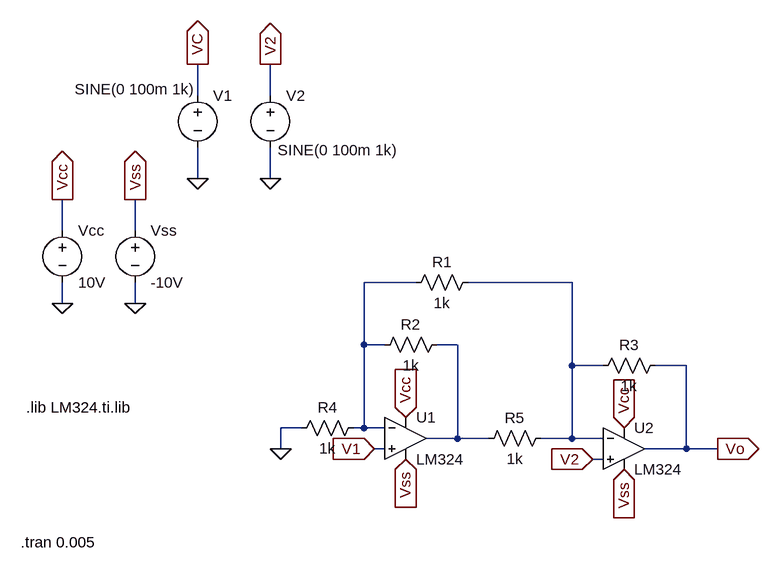
[diagram p0: schematic Circuito1.asc]
Circuito1.asc, the LTspice schematic file:
Version 4.1
SHEET 1 880 680
WIRE -336 -320 -336 -368
WIRE -224 -320 -224 -368
WIRE -336 -192 -336 -240
WIRE -224 -192 -224 -240
WIRE -544 -112 -544 -160
WIRE -432 -112 -432 -160
WIRE 0 -32 -80 -32
WIRE 240 -32 80 -32
WIRE -544 0 -544 -32
WIRE -432 0 -432 -32
WIRE -80 64 -80 -32
WIRE -48 64 -80 64
WIRE 64 64 32 64
WIRE 240 96 240 -32
WIRE 288 96 240 96
WIRE 416 96 368 96
WIRE -176 192 -208 192
WIRE -80 192 -80 64
WIRE -80 192 -96 192
WIRE -48 192 -80 192
WIRE 64 208 64 64
WIRE 64 208 16 208
WIRE 112 208 64 208
WIRE 240 208 240 96
WIRE 240 208 192 208
WIRE 288 208 240 208
WIRE -208 224 -208 192
WIRE -48 224 -64 224
WIRE 416 224 416 96
WIRE 416 224 352 224
WIRE 464 224 416 224
WIRE 288 240 272 240
FLAG -64 224 V1
IOPIN -64 224 In
FLAG -16 176 Vcc
IOPIN -16 176 In
FLAG 320 192 Vcc
IOPIN 320 192 In
FLAG 320 256 Vss
IOPIN 320 256 In
FLAG -16 240 Vss
IOPIN -16 240 In
FLAG 272 240 V2
IOPIN 272 240 In
FLAG 464 224 Vo
IOPIN 464 224 Out
FLAG -208 224 0
FLAG -544 0 0
FLAG -432 0 0
FLAG -544 -160 Vcc
IOPIN -544 -160 Out
FLAG -432 -160 Vss
IOPIN -432 -160 Out
FLAG -336 -368 VC
IOPIN -336 -368 Out
FLAG -224 -368 V2
IOPIN -224 -368 Out
FLAG -336 -192 0
FLAG -224 -192 0
SYMBOL OpAmps\\opamp2 -16 144 R0
SYMATTR InstName U1
SYMATTR Value LM324
SYMBOL res 96 -48 R90
WINDOW 0 0 56 VBottom 2
WINDOW 3 32 56 VTop 2
SYMATTR InstName R1
SYMATTR Value 1k
SYMBOL res 48 48 R90
WINDOW 0 0 56 VBottom 2
WINDOW 3 32 56 VTop 2
SYMATTR InstName R2
SYMATTR Value 1k
SYMBOL res 384 80 R90
WINDOW 0 0 56 VBottom 2
WINDOW 3 32 56 VTop 2
SYMATTR InstName R3
SYMATTR Value 1k
SYMBOL res -80 176 R90
WINDOW 0 0 56 VBottom 2
WINDOW 3 32 56 VTop 2
SYMATTR InstName R4
SYMATTR Value 1k
SYMBOL OpAmps\\opamp2 320 160 R0
SYMATTR InstName U2
SYMATTR Value LM324
SYMBOL res 208 192 R90
WINDOW 0 0 56 VBottom 2
WINDOW 3 32 56 VTop 2
SYMATTR InstName R5
SYMATTR Value 1k
SYMBOL voltage -544 -128 R0
SYMATTR InstName Vcc
SYMATTR Value 10V
SYMBOL voltage -432 -128 R0
SYMATTR InstName Vss
SYMATTR Value -10V
SYMBOL voltage -336 -336 R0
WINDOW 3 -189 6 Left 2
WINDOW 123 0 0 Left 0
WINDOW 39 0 0 Left 0
SYMATTR InstName V1
SYMATTR Value SINE(0 100m 1k)
SYMBOL voltage -224 -336 R0
WINDOW 3 11 100 Left 2
WINDOW 123 0 0 Left 0
WINDOW 39 0 0 Left 0
SYMATTR InstName V2
SYMATTR Value SINE(0 100m 1k)
TEXT -600 160 Left 2 !.lib LM324.ti.lib
TEXT -608 368 Left 2 !.tran 0.005

The netlist it stands for:
* Circuito1.asc
X§U1 V1 N001 Vcc Vss N003 LM324  ; pins In+ In- V+ V- OUT
R1 N002 N001 1k
R2 N003 N001 1k
R3 Vo N002 1k
R4 N001 0 1k
X§U2 V2 N002 Vcc Vss Vo LM324  ; pins In+ In- V+ V- OUT
R5 N002 N003 1k
Vcc Vcc 0 10V
Vss Vss 0 -10V
V1 VC 0 SINE(0 100m 1k)
V2 V2 0 SINE(0 100m 1k)
.lib LM324.ti.lib
.tran 0.005
.backanno
.end